# Altium schematic sheet ultrasonic_top.SchDoc: Ultrasonic
size Letter; Author: Kuo, Huang; Revision: 2.0; SheetNumber: 1; SheetTotal: 7
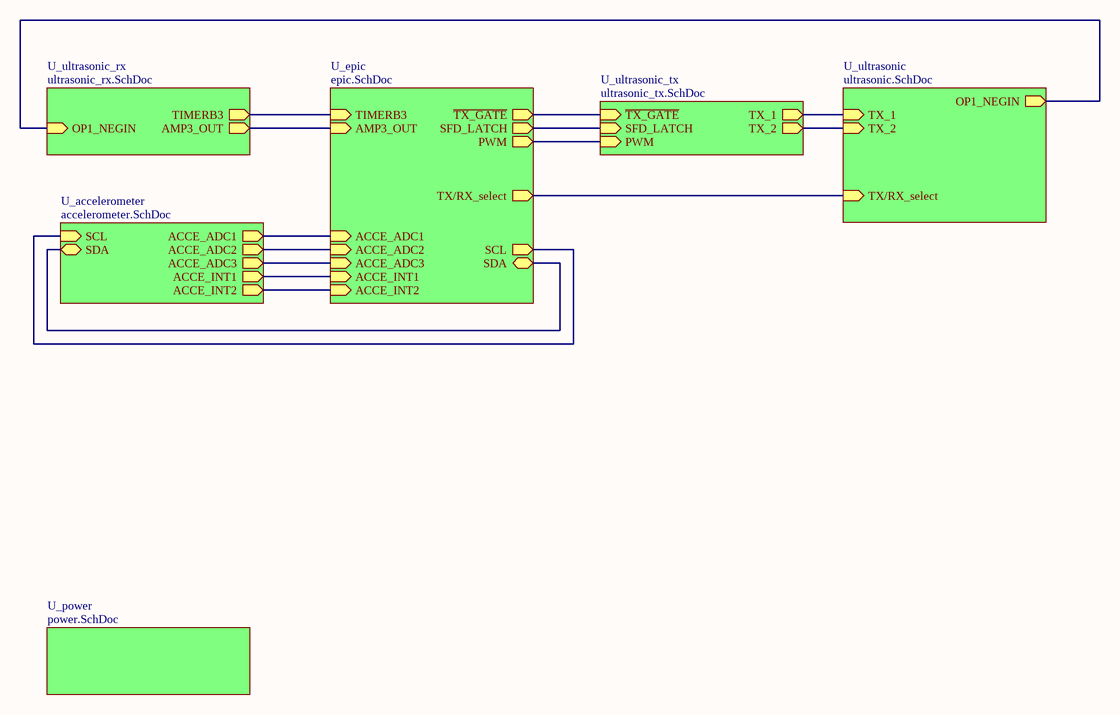
[diagram p0: ultrasonic_top.SchDoc]

## Sub-sheets
U_accelerometer = accelerometer.SchDoc: ACCE_ADC1 (out), ACCE_ADC2 (out), ACCE_ADC3 (out), ACCE_INT1 (out), ACCE_INT2 (out), SCL (in), SDA (bidir)
U_epic = epic.SchDoc: TIMERB3 (in), PWM (out), TX/RX_select (out), ~{TX_GATE} (out), AMP3_OUT (in), ACCE_ADC1 (in), ACCE_ADC2 (in), ACCE_ADC3 (in), ACCE_INT1 (in), ACCE_INT2 (in), SCL (out), SDA (bidir), SFD_LATCH (out)
U_power = power.SchDoc: no entries
U_ultrasonic = ultrasonic.SchDoc: TX/RX_select (in), OP1_NEGIN (out), TX_1 (in), TX_2 (in)
U_ultrasonic_rx = ultrasonic_rx.SchDoc: TIMERB3 (out), OP1_NEGIN (in), AMP3_OUT (out)
U_ultrasonic_tx = ultrasonic_tx.SchDoc: TX_1 (out), TX_2 (out), ~{TX_GATE} (in), SFD_LATCH (in), PWM (in)

## Nets
(unnamed): sheet U_accelerometer/ACCE_ADC1, sheet U_epic/ACCE_ADC1
(unnamed): sheet U_accelerometer/ACCE_ADC2, sheet U_epic/ACCE_ADC2
(unnamed): sheet U_accelerometer/ACCE_ADC3, sheet U_epic/ACCE_ADC3
(unnamed): sheet U_accelerometer/ACCE_INT1, sheet U_epic/ACCE_INT1
(unnamed): sheet U_accelerometer/ACCE_INT2, sheet U_epic/ACCE_INT2
(unnamed): sheet U_accelerometer/SCL, sheet U_epic/SCL
(unnamed): sheet U_accelerometer/SDA, sheet U_epic/SDA
(unnamed): sheet U_epic/TIMERB3, sheet U_ultrasonic_rx/TIMERB3
(unnamed): sheet U_epic/PWM, sheet U_ultrasonic_tx/PWM
(unnamed): sheet U_epic/TX/RX_select, sheet U_ultrasonic/TX/RX_select
(unnamed): sheet U_epic/~{TX_GATE}, sheet U_ultrasonic_tx/~{TX_GATE}
(unnamed): sheet U_epic/AMP3_OUT, sheet U_ultrasonic_rx/AMP3_OUT
(unnamed): sheet U_epic/SFD_LATCH, sheet U_ultrasonic_tx/SFD_LATCH
(unnamed): sheet U_ultrasonic/OP1_NEGIN, sheet U_ultrasonic_rx/OP1_NEGIN
(unnamed): sheet U_ultrasonic/TX_1, sheet U_ultrasonic_tx/TX_1
(unnamed): sheet U_ultrasonic/TX_2, sheet U_ultrasonic_tx/TX_2

## Notes on the sheet
- Title
- Date:
- Author:
- Revision:
- Sheet
- of
- University of Michigan
- File: